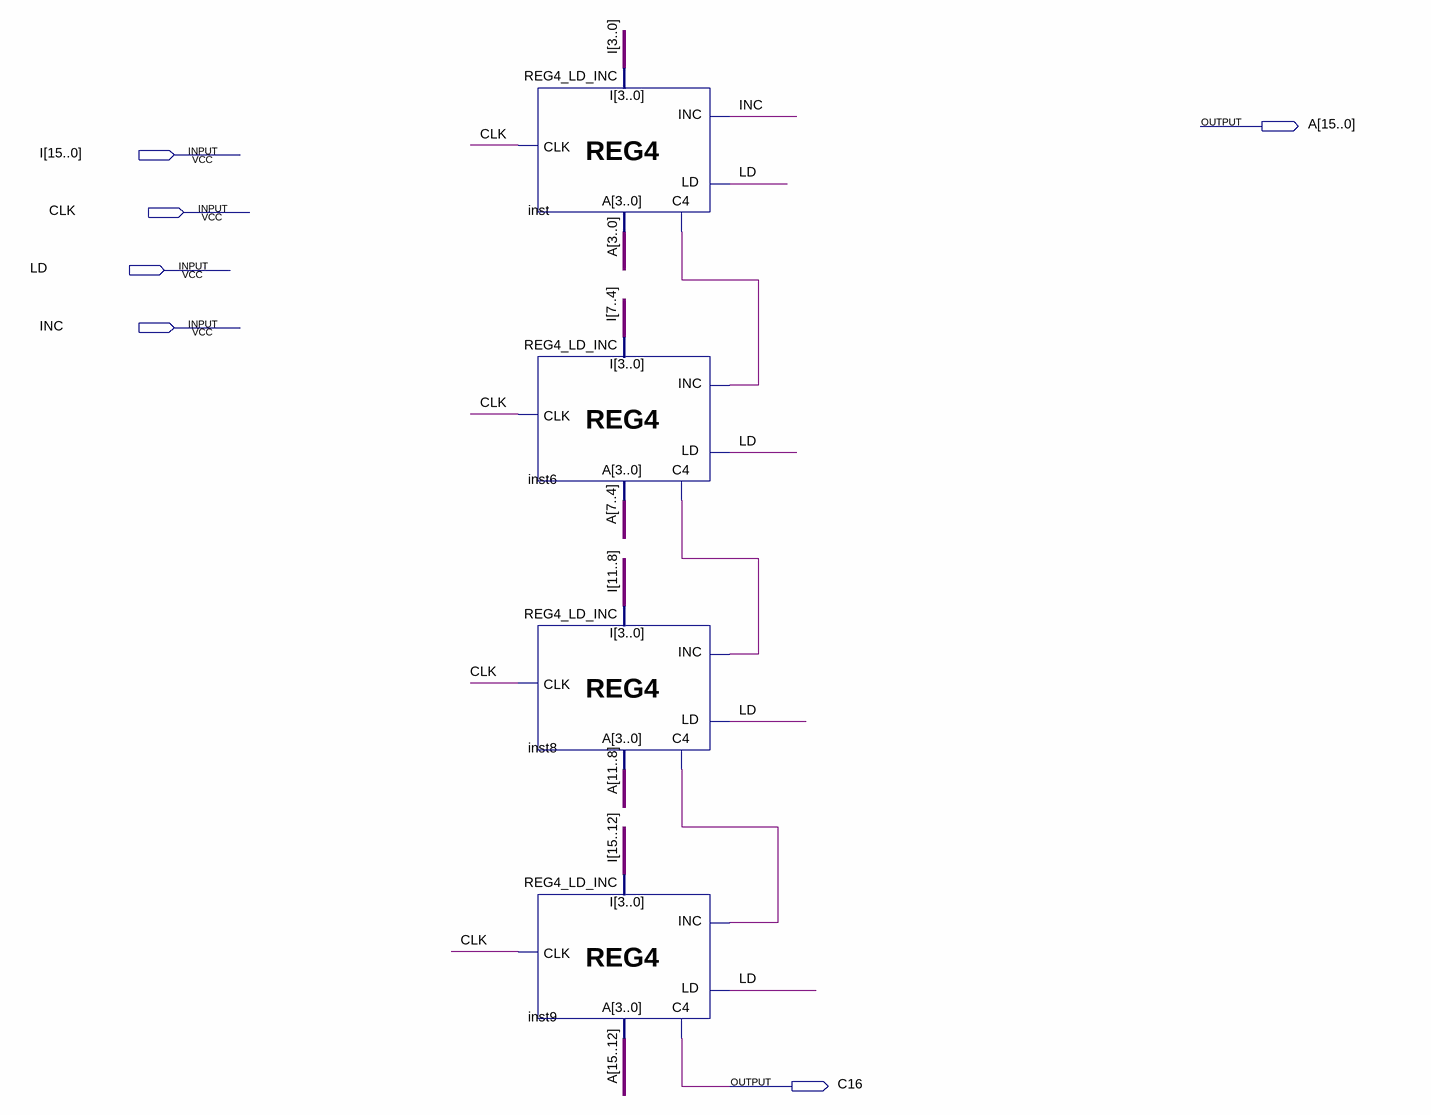
[diagram p0: schematic sheet]
// Quartus schematic REG16_LD_INC.bdf as structural Verilog: 4 symbols, 6 pins
module REG16_LD_INC (
  input  [15:0] I,
  input  CLK,
  input  LD,
  input  INC,
  output [15:0] A,
  output C16
);

  wire inst6_c4, inst8_c4, inst_c4;

  REG4_LD_INC inst (.LD(LD), .INC(INC), .CLK(CLK), .I(I[3:0]), .A(A[3:0]), .C4(inst_c4));
  REG4_LD_INC inst6 (.LD(LD), .INC(inst_c4), .CLK(CLK), .I(I[7:4]), .A(A[7:4]), .C4(inst6_c4));
  REG4_LD_INC inst8 (.LD(LD), .INC(inst6_c4), .CLK(CLK), .I(I[11:8]), .A(A[11:8]), .C4(inst8_c4));
  REG4_LD_INC inst9 (.LD(LD), .INC(inst8_c4), .CLK(CLK), .I(I[15:12]), .A(A[15:12]), .C4(C16));
endmodule
